# Altium project GateWay.PrjPCB
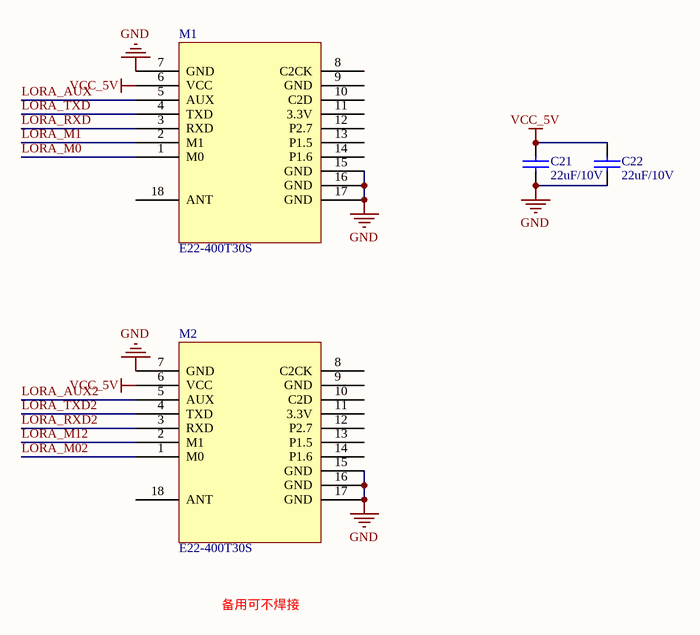
[diagram p0: LORA.SchDoc]
4 sheets, 54 parts. Net scope: global (net labels, ports and power ports of the same name join across sheets).
Board file: GateWay.PcbDoc
Sheets:
  LORA.SchDoc
  POWER.SchDoc
  CONNECTOR.SchDoc
  rs485.SchDoc

## Sheet LORA.SchDoc
size A4

### Parts
C21  22uF/10V  [1206C]
C22  22uF/10V  [1206C]
M1  E22-400T30S  [E22-400T30S]
M2  E22-400T30S  [E22-400T30S]

### Nets
GND: C21.2 C22.2 M1.7(GND) M1.15(GND) M1.16(GND) M1.17(GND) M2.7(GND) M2.15(GND) M2.16(GND) M2.17(GND)  [project net AGND]
VCC_5V: C21.1 C22.1 M1.6(VCC) M2.6(VCC)
LORA_AUX: M1.5(AUX)
LORA_AUX2: M2.5(AUX)
LORA_M0: M1.1(M0)
LORA_M1: M1.2(M1)
LORA_M02: M2.1(M0)
LORA_M12: M2.2(M1)
LORA_RXD: M1.3(RXD)
LORA_RXD2: M2.3(RXD)
LORA_TXD: M1.4(TXD)
LORA_TXD2: M2.4(TXD)

Not connected (* = marked no-connect by the designer): M1 8(C2CK) 9(GND) 10(C2D) 11(3.3V) 12(P2.7) 13(P1.5) 14(P1.6) 18(ANT); M2 8(C2CK) 9(GND) 10(C2D) 11(3.3V) 12(P2.7) 13(P1.5) 14(P1.6) 18(ANT)

### Notes on the sheet
- 备用可不焊接

### Library data of the parts
C21 C22 = CAP: Capacitor

## Sheet POWER.SchDoc
size A3
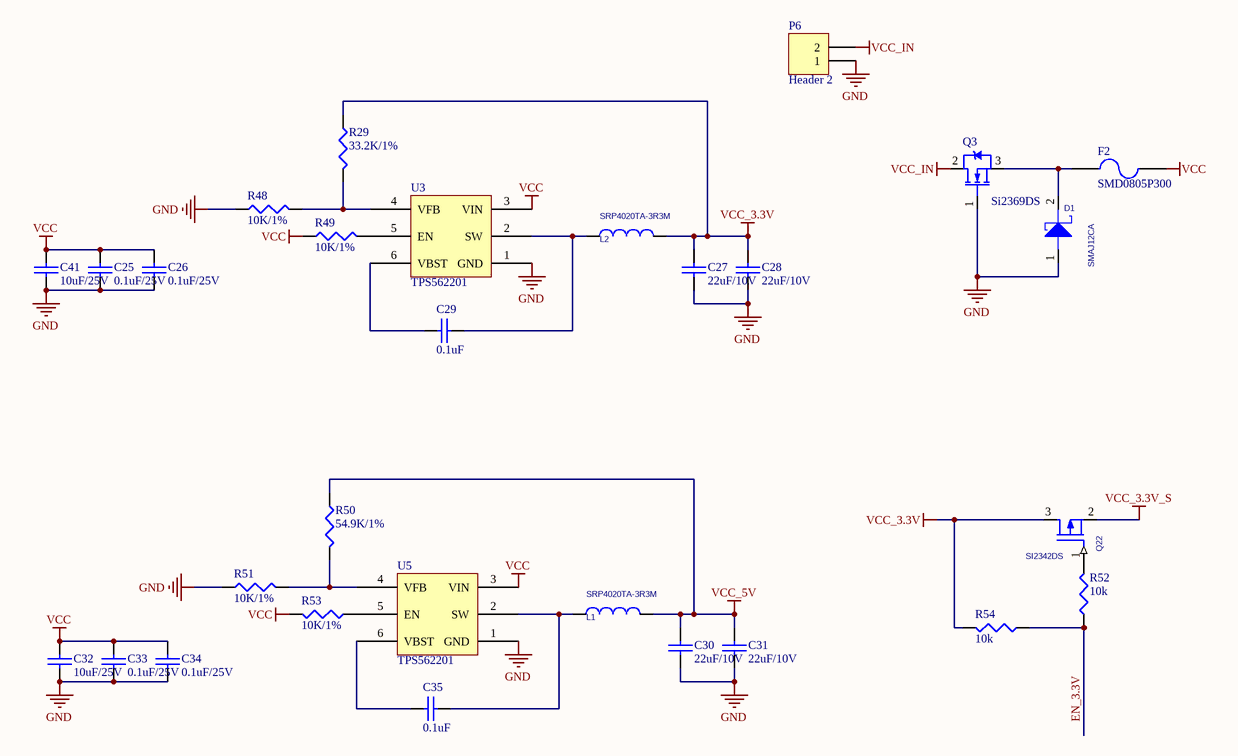
[diagram p1: POWER.SchDoc]

### Parts
C25  0.1uF/25V  [0603C]
C26  0.1uF/25V  [0603C]
C27  22uF/10V  [1206C]
C28  22uF/10V  [1206C]
C29  0.1uF  [0603C]
C30  22uF/10V  [1206C]
C31  22uF/10V  [1206C]
C32  10uF/25V  [0603C]
C33  0.1uF/25V  [0603C]
C34  0.1uF/25V  [0603C]
C35  0.1uF  [0603C]
C41  10uF/25V  [0603C]
D1  SMAJ12CA  [SMA]
F2  SMD0805P300  [0805R]
L1  SRP4020TA-3R3M  [CD_4*4]
L2  SRP4020TA-3R3M  [CD_4*4]
P6  Header 2  [2X2.54MMZ]
Q3  Si2369DS  [sot23-3]
Q22  SI2342DS  [SOT23]
R29  33.2K/1%  [0603R]
R48  10K/1%  [0603R]
R49  10K/1%  [0603R]
R50  54.9K/1%  [0603R]
R51  10K/1%  [0603R]
R52  10k  [0603R]
R53  10K/1%  [0603R]
R54  10k  [0603R]
U3  TPS562201  [SOT-23-6]
U5  TPS562201  [SOT-23-6]

### Nets
GND: C25.1 C26.1 C27.2 C28.2 C30.2 C31.2 C32.1 C33.1 C34.1 C41.1 D1.1 P6.1 Q3.1(G) R48.1 R51.1 U3.1(GND) U5.1(GND)  [project net AGND]
VCC: C25.2 C26.2 C32.2 C33.2 C34.2 C41.2 F2.2 R49.1 R53.2 U3.3(VIN) U5.3(VIN)
VCC_3.3V: C27.1 C28.1 L2.2 Q22.3(SOURCE) R29.1 R54.2
VCC_3.3V_S: Q22.2(DRAIN)
VCC_5V: C30.1 C31.1 L1.2 R50.1
VCC_IN: P6.2 Q3.2(D)
EN_3.3V: R52.1 R54.1
NetC29_1: C29.1 L2.1 U3.2(SW)
NetC29_2: C29.2 U3.6(VBST)
NetC35_1: C35.1 L1.1 U5.2(SW)
NetC35_2: C35.2 U5.6(VBST)
NetD1_2: D1.2 F2.1 Q3.3(S)
NetQ22_1: Q22.1(GATE) R52.2
NetR29_2: R29.2 R48.2 U3.4(VFB)
NetR49_2: R49.2 U3.5(EN)
NetR50_2: R50.2 R51.2 U5.4(VFB)
NetR53_1: R53.1 U5.5(EN)

### Library data of the parts
C25-C35 C41 = CAP: Capacitor
D1 = DIODE_SCHOTTKY_0: PCB DECAL: DO_214AC; Source_Path: E:\AIH\WORK\A\LIBRARY1.OLB; Value: SMAJ12CA
F2 = Fuse 2: Fuse; Published: 8-Jun-2000; LatestRevisionDate: 17-Jul-2002; LatestRevisionNote: Re-released for DXP Platform.; PackageReference: PIN-W2/E2.8; Publisher: Altium Limited
L1 L2 = INDUCTOR_1
P6 = Header 2: Header, 2-Pin; LatestRevisionDate: 17-Jul-2002; LatestRevisionNote: Re-released for DXP Platform.; Publisher: Altium Limited
Q3 = NCE4060K: NMOSFET
Q22 = MOSFET P_1: Color: RGB(255,  0,  0)
R29 R48-R54 = RES1: P: 1/8W

## Sheet CONNECTOR.SchDoc
size A3
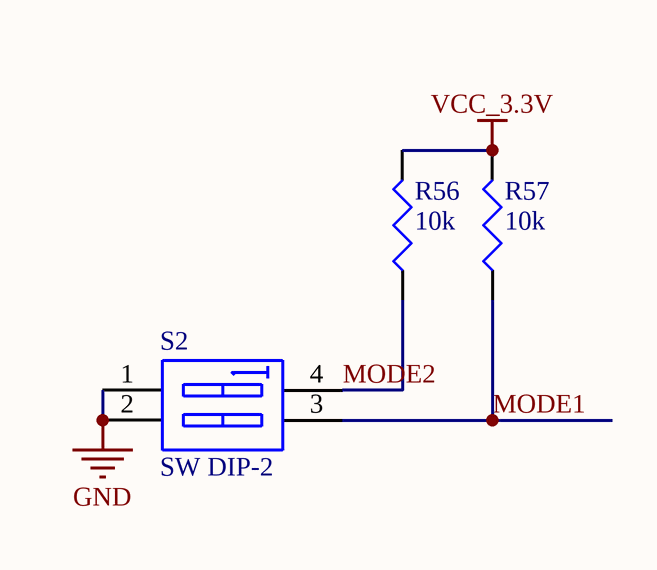
[diagram p2: CONNECTOR.SchDoc]

### Parts
R56  10k  [0603R]
R57  10k  [0603R]
S2  SW DIP-2  [SW_SMT_4]

### Nets
GND: S2.1(A1) S2.2(A2)  [project net AGND]
VCC_3.3V: R56.2 R57.2
MODE1: R57.1 S2.3(B2)
MODE2: R56.1 S2.4(B1)

### Library data of the parts
R56 R57 = RES1: P: 1/8W
S2 = SW DIP-2: DIP Switch, 2 Position, SPST; Published: 24-Mar-1999; LatestRevisionDate: 17-Jul-2002; LatestRevisionNote: Re-released for DXP Platform.; PackageReference: DIP-4; Publisher: Altium Limited

## Sheet rs485.SchDoc
size A4
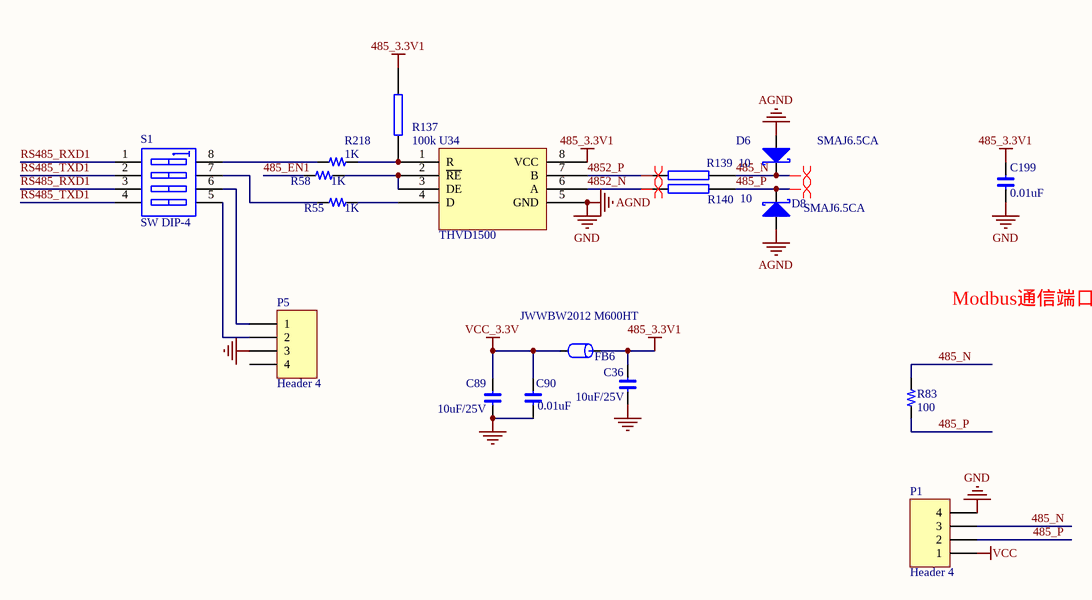
[diagram p3: rs485.SchDoc]

### Parts
C36  10uF/25V  [0603C]
C89  10uF/25V  [0603C]
C90  0.01uF  [0603C]
C199  0.01uF  [0603C]
D6  SMAJ6.5CA  [SMA]
D8  SMAJ6.5CA  [SMA]
FB6  JWWBW2012 M600HT  [0805CZ]
P1  Header 4  [4X2.54MMZ]
P5  Header 4  [4X2.54MMZ]
R55  1K  [0603R]
R58  1K  [0603R]
R83  100  [0603R]
R137  100k  [0603R]
R139  10  [1206R]
R140  10  [1206R]
R218  1K  [0603R]
S1  SW DIP-4  [SW_SMT_8]
U34  THVD1500  [so-8]

### Nets
485_3.3V1: C36.2 C199.2 FB6.1 R137.2 U34.8(VCC)
AGND: C36.1 C89.1 C90.1 C199.1 D6.1(A) D8.1(A) P1.4 P5.3 U34.5(GND)  [also labelled GND]
VCC: P1.1
VCC_3.3V: C89.2 C90.2 FB6.2
485_EN1: R58.2
485_N: D6.2(K) P1.3 R83.2 R139.1
485_P: D8.2(K) P1.2 R83.1 R140.1
4852_N: R140.2 U34.6(A)
4852_P: R139.2 U34.7(B)
RS485_RXD1: S1.1(A1) S1.3(A3)
RS485_TXD1: S1.2(A2) S1.4(A4)
NetP5_1: P5.1 S1.6(B3)
NetP5_2: P5.2 S1.5(B4)
NetR55_1: R55.1 U34.4(D)
NetR55_2: R55.2 S1.7(B2)
NetR58_1: R58.1 U34.2(~{RE}) U34.3(DE)
NetR137_1: R137.1 R218.1 U34.1(R)
NetR218_2: R218.2 S1.8(B1)

Not connected (* = marked no-connect by the designer): P5 4

### Layout directives
differential pair: 485_N, 485_P, 4852_N, 4852_P

### Notes on the sheet
- Modbus通信端口

### Library data of the parts
C36 C89 C90 C199 = C
D6 D8 = DIODE S: Schottky Diode
FB6 = FB: Part Field 1: 磁珠/0603/1K ohm/100MHz; FB: BLM18BD102SN1(muRata); Text Field1: FB
P1 P5 = Header 4: Header, 4-Pin; LatestRevisionDate: 17-Jul-2002; LatestRevisionNote: Re-released for DXP Platform.; Publisher: Altium Limited
R55 R58 R83 R218 = R
R137 R139 R140 = RES2
S1 = SW DIP-4: DIP Switch, 4 Position, SPST; Published: 24-Mar-1999; LatestRevisionDate: 29-May-2009; LatestRevisionNote: IPC-7351 Footprint Added.; PackageVersion: Dec-2002; PackageReference: SO8; Publisher: Altium Limited; PackageDescription: 8-Pin Small Outline Integrated Circuit 1.27 mm Pitch; Code_JEDEC: MS-012-AA; Code_IPC: SOIC127P600-8
U34 = SN65HVD06D

## Nets that join several sheets
AGND: LORA (10 pins), POWER (17 pins), CONNECTOR (S2.1 S2.2), rs485 (9 pins)
VCC: POWER (11 pins), rs485 (P1.1)
VCC_3.3V: POWER (6 pins), CONNECTOR (R56.2 R57.2), rs485 (C89.2 C90.2 FB6.2)
VCC_5V: LORA (C21.1 C22.1 M1.6 M2.6), POWER (C30.1 C31.1 L1.2 R50.1)